# Altium project ZYNQ-HS-DEV.PrjPcb (part 4 of 4)

## Sheet ZHSD-PL-CONNS.SchDoc
size A4; DrawnBy: UGUR KELES; DocumentNumber: 17; SheetNumber: 17; SheetTotal: 17; Size: A4
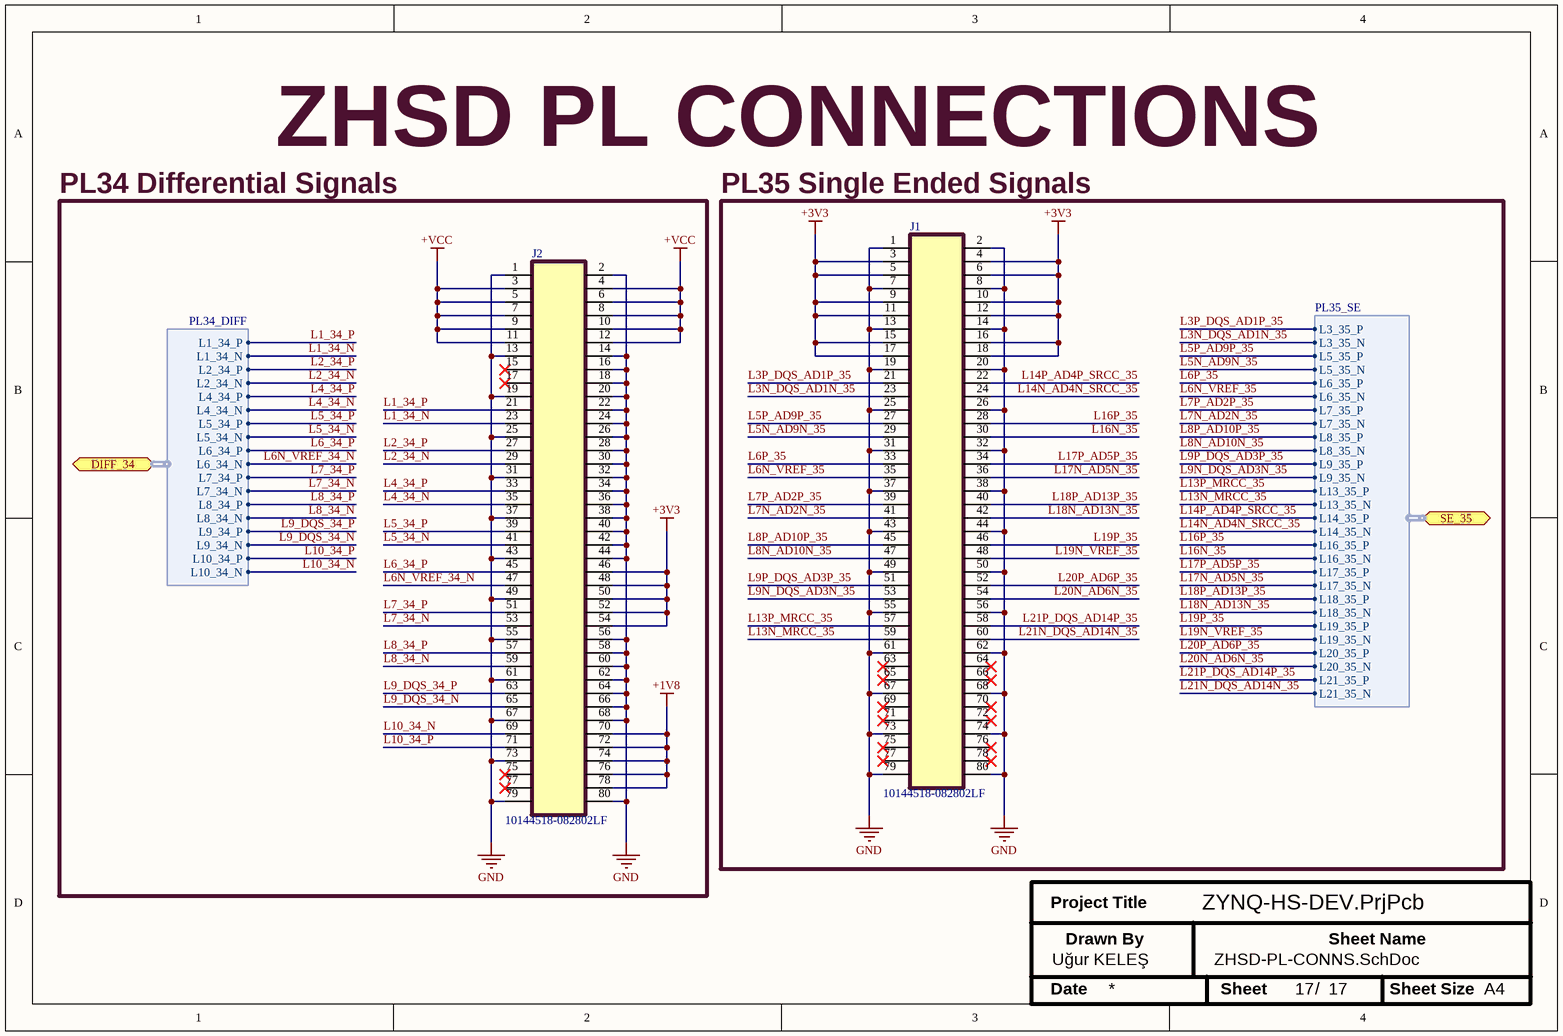
[diagram p16: ZHSD-PL-CONNS.SchDoc]

### Parts
J1  10144518-082802LF  [10144518-082802LF]
J2  10144518-082802LF  [10144518-082802LF]

### Blocks framed on the sheet
PL34 Differential Signals: J2
PL35 Single Ended Signals: J1

### Ports
DIFF_34 (bidir, harness PL34_DIFF, see ZHSD-Block[8400,1700], ZHSD-ZYNQ-PL[8700,7800]), SE_35 (bidir, harness PL35_SE, see ZHSD-Block[8400,1400], ZHSD-ZYNQ-PL[14400,2800])

### Harnesses
PL34_DIFF: L1_34_P, L1_34_N, L2_34_P, L2_34_N, L4_34_P, L4_34_N, L5_34_P, L5_34_N, L6_34_P, L6_34_N, L7_34_P, L7_34_N, L8_34_P, L8_34_N, L9_34_P, L9_34_N, L10_34_P, L10_34_N
PL35_SE: L3_35_P, L3_35_N, L5_35_P, L5_35_N, L6_35_P, L6_35_N, L7_35_P, L7_35_N, L8_35_P, L8_35_N, L9_35_P, L9_35_N, L13_35_P, L13_35_N, L14_35_P, L14_35_N, L16_35_P, L16_35_N, L17_35_P, L17_35_N, L18_35_P, L18_35_N, L19_35_P, L19_35_N, L20_35_P, L20_35_N, L21_35_P, L21_35_N

### Nets
+1V8: J2.70 J2.72 J2.74 J2.76 J2.78
+3V3: J1.3 J1.4 J1.5 J1.6 J1.9 J1.10 J1.11 J1.12 J1.15 J1.16 J1.17 J1.18 J2.46 J2.48 J2.50 J2.52 J2.54
+VCC: J2.3 J2.4 J2.5 J2.6 J2.7 J2.8 J2.9 J2.10 J2.11 J2.12
GND: J1.1 J1.2 J1.7 J1.8 J1.13 J1.14 J1.19 J1.20 J1.25 J1.26 J1.31 J1.32 J1.37 J1.38 J1.43 J1.44 J1.49 J1.50 J1.55 J1.56 J1.61 J1.62 J1.67 J1.68 J1.73 J1.74 J1.79 J1.80 J2.1 J2.2 J2.13 J2.14 J2.16 J2.18 J2.19 J2.20 J2.22 J2.24 J2.25 J2.26 J2.28 J2.30 J2.31 J2.32 J2.34 J2.36 J2.37 J2.38 J2.40 J2.42 J2.43 J2.44 J2.49 J2.55 J2.56 J2.58 J2.60 J2.61 J2.62 J2.64 J2.66 J2.67 J2.68 J2.73 J2.79 J2.80
L1_34_N: J2.23 ; port DIFF_34.L1_34_N  [project net DIFF34.L1_34_N]
L1_34_P: J2.21 ; port DIFF_34.L1_34_P  [project net DIFF34.L1_34_P]
L2_34_N: J2.29 ; port DIFF_34.L2_34_N  [project net DIFF34.L2_34_N]
L2_34_P: J2.27 ; port DIFF_34.L2_34_P  [project net DIFF34.L2_34_P]
L3N_DQS_AD1N_35: J1.23 ; port SE_35.L3_35_N  [project net SE35.L3_35_N]
L3P_DQS_AD1P_35: J1.21 ; port SE_35.L3_35_P  [project net SE35.L3_35_P]
L4_34_N: J2.35 ; port DIFF_34.L4_34_N  [project net DIFF34.L4_34_N]
L4_34_P: J2.33 ; port DIFF_34.L4_34_P  [project net DIFF34.L4_34_P]
L5_34_N: J2.41 ; port DIFF_34.L5_34_N  [project net DIFF34.L5_34_N]
L5_34_P: J2.39 ; port DIFF_34.L5_34_P  [project net DIFF34.L5_34_P]
L5N_AD9N_35: J1.29 ; port SE_35.L5_35_N  [project net SE35.L5_35_N]
L5P_AD9P_35: J1.27 ; port SE_35.L5_35_P  [project net SE35.L5_35_P]
L6_34_P: J2.45 ; port DIFF_34.L6_34_P  [project net DIFF34.L6_34_P]
L6N_VREF_34_N: J2.47 ; port DIFF_34.L6_34_N  [project net DIFF34.L6_34_N]
L6N_VREF_35: J1.35 ; port SE_35.L6_35_N  [project net SE35.L6_35_N]
L6P_35: J1.33 ; port SE_35.L6_35_P  [project net SE35.L6_35_P]
L7_34_N: J2.53 ; port DIFF_34.L7_34_N  [project net DIFF34.L7_34_N]
L7_34_P: J2.51 ; port DIFF_34.L7_34_P  [project net DIFF34.L7_34_P]
L7N_AD2N_35: J1.41 ; port SE_35.L7_35_N  [project net SE35.L7_35_N]
L7P_AD2P_35: J1.39 ; port SE_35.L7_35_P  [project net SE35.L7_35_P]
L8_34_N: J2.59 ; port DIFF_34.L8_34_N  [project net DIFF34.L8_34_N]
L8_34_P: J2.57 ; port DIFF_34.L8_34_P  [project net DIFF34.L8_34_P]
L8N_AD10N_35: J1.47 ; port SE_35.L8_35_N  [project net SE35.L8_35_N]
L8P_AD10P_35: J1.45 ; port SE_35.L8_35_P  [project net SE35.L8_35_P]
L9_DQS_34_N: J2.65 ; port DIFF_34.L9_34_N  [project net DIFF34.L9_34_N]
L9_DQS_34_P: J2.63 ; port DIFF_34.L9_34_P  [project net DIFF34.L9_34_P]
L9N_DQS_AD3N_35: J1.53 ; port SE_35.L9_35_N  [project net SE35.L9_35_N]
L9P_DQS_AD3P_35: J1.51 ; port SE_35.L9_35_P  [project net SE35.L9_35_P]
L10_34_N: J2.69 ; port DIFF_34.L10_34_N  [project net DIFF34.L10_34_N]
L10_34_P: J2.71 ; port DIFF_34.L10_34_P  [project net DIFF34.L10_34_P]
L13N_MRCC_35: J1.59 ; port SE_35.L13_35_N  [project net SE35.L13_35_N]
L13P_MRCC_35: J1.57 ; port SE_35.L13_35_P  [project net SE35.L13_35_P]
L14N_AD4N_SRCC_35: J1.24 ; port SE_35.L14_35_N  [project net SE35.L14_35_N]
L14P_AD4P_SRCC_35: J1.22 ; port SE_35.L14_35_P  [project net SE35.L14_35_P]
L16N_35: J1.30 ; port SE_35.L16_35_N  [project net SE35.L16_35_N]
L16P_35: J1.28 ; port SE_35.L16_35_P  [project net SE35.L16_35_P]
L17N_AD5N_35: J1.36 ; port SE_35.L17_35_N  [project net SE35.L17_35_N]
L17P_AD5P_35: J1.34 ; port SE_35.L17_35_P  [project net SE35.L17_35_P]
L18N_AD13N_35: J1.42 ; port SE_35.L18_35_N  [project net SE35.L18_35_N]
L18P_AD13P_35: J1.40 ; port SE_35.L18_35_P  [project net SE35.L18_35_P]
L19N_VREF_35: J1.48 ; port SE_35.L19_35_N  [project net SE35.L19_35_N]
L19P_35: J1.46 ; port SE_35.L19_35_P  [project net SE35.L19_35_P]
L20N_AD6N_35: J1.54 ; port SE_35.L20_35_N  [project net SE35.L20_35_N]
L20P_AD6P_35: J1.52 ; port SE_35.L20_35_P  [project net SE35.L20_35_P]
L21N_DQS_AD14N_35: J1.60 ; port SE_35.L21_35_N  [project net SE35.L21_35_N]
L21P_DQS_AD14P_35: J1.58 ; port SE_35.L21_35_P  [project net SE35.L21_35_P]

Not connected (* = marked no-connect by the designer): J1 63* 64* 65* 66* 69* 70* 71* 72* 75* 76* 77* 78*; J2 15* 17* 75* 77*

### Notes on the sheet
- ZHSD PL CONNECTIONS
- Project Title
- Uğur KELEŞ
- Drawn By
- Sheet Name
- Date
- Sheet
- /
- Sheet Size
- A4

### Library data of the parts
J1 J2 = 10144518-082802LF: BergStak® Lite 0.80mm, Board-to-Board Connector, 80 Positions, Dual Row, Vertical Header; Manufacturer: Amphenol; MPN: 10144518-082802LF

## Nets that join several sheets
+1V0: ZHSD-ZYNQ-PWR (32 pins), ZHSD-POWER (5 pins)
+1V8: ZHSD-ZYNQ-CONFIG (U300.F11 U300.J9), ZHSD-ZYNQ-PWR (25 pins), ZHSD-ZYNQ-MIO (10 pins), ZHSD-USB-OTG (8 pins), ZHSD-ETHERNET (C1110.2 C1111.2 FB1101.1), ZHSD-USB-UART (Q1200.1 Q1201.1 R1201.1 R1204.1), ZHSD-RS485-CAN (7 pins), ZHSD-HDMI (FB1501.1 FB1502.1 FB1503.1), ZHSD-POWER (5 pins), ZHSD-PL-CONNS (5 pins)
+1V35: ZHSD-ZYNQ-PWR (16 pins), ZHSD-ZYNQ-DDR (R625.2), ZHSD-DDR3L (76 pins), ZHSD-POWER (8 pins)
+3V3: ZHSD-ZYNQ-CONFIG (10 pins), ZHSD-JTAG (C516.2 J501.6), ZHSD-ZYNQ-PWR (44 pins), ZHSD-BOOT-STORAGE (34 pins), ZHSD-ZYNQ-MIO (9 pins), ZHSD-USB-OTG (9 pins), ZHSD-ETHERNET (13 pins), ZHSD-RS485-CAN (6 pins), ZHSD-ZYNQ-PL (7 pins), ZHSD-HDMI (8 pins), ZHSD-MIPI-CSI2 (J1600.15 R1604.2 R1605.2), ZHSD-POWER (9 pins), ZHSD-PL-CONNS (17 pins)
+5V: ZHSD-USB-OTG (C1007.2 U1001.5), ZHSD-RS485-CAN (5 pins), ZHSD-HDMI (C1511.2 J1500.18 R1503.2 R1504.2), ZHSD-POWER (17 pins)
+VCC: ZHSD-POWER (6 pins), ZHSD-PL-CONNS (10 pins)
CHASSIS: ZHSD-JTAG (J500.SH), ZHSD-ZYNQ-PWR (C357.2 R300.1), ZHSD-USB-OTG (J1000.SH), ZHSD-ETHERNET (J1100.SH), ZHSD-USB-UART (J1200.SH), ZHSD-HDMI (J1500.S1 J1500.S2 J1500.S3 J1500.S4)
GND: ZHSD-ZYNQ-CONFIG (10 pins), ZHSD-JTAG (39 pins), ZHSD-ZYNQ-PWR (118 pins), ZHSD-BOOT-STORAGE (31 pins), ZHSD-ZYNQ-MIO (19 pins), ZHSD-USB-OTG (20 pins), ZHSD-ETHERNET (27 pins), ZHSD-USB-UART (12 pins), ZHSD-RS485-CAN (13 pins), ZHSD-ZYNQ-PL (9 pins), ZHSD-HDMI (86 pins), ZHSD-MIPI-CSI2 (J1600.1 J1600.4 J1600.7 J1600.10), ZHSD-ZYNQ-DDR (15 pins), ZHSD-DDR3L (86 pins), ZHSD-POWER (43 pins), ZHSD-PL-CONNS (66 pins)
VTT: ZHSD-ZYNQ-DDR (35 pins), ZHSD-POWER (C212.2 U203.3 U203.5)
VTT_REF: ZHSD-ZYNQ-DDR (C600.2 C601.2 U300.H6 U300.P6), ZHSD-DDR3L (6 pins), ZHSD-POWER (C213.2 U203.6)
3V3_PG: ZHSD-ZYNQ-MIO (C802.2 R801.1 U800.2), ZHSD-POWER (R211.2 U205.8)
CAM_CLK: ZHSD-ZYNQ-PL (U300.U9), ZHSD-MIPI-CSI2 (J1600.12)
CAM_GPIO: ZHSD-ZYNQ-PL (U300.U7), ZHSD-MIPI-CSI2 (J1600.11)
CAM_SCL: ZHSD-ZYNQ-PL (U300.T5), ZHSD-MIPI-CSI2 (J1600.13 R1605.1)
CAM_SDA: ZHSD-ZYNQ-PL (U300.U5), ZHSD-MIPI-CSI2 (J1600.14 R1604.1)
DDR_A0: ZHSD-ZYNQ-DDR (R600.2 U300.N2), ZHSD-DDR3L (U700.N3 U701.N3)
DDR_A1: ZHSD-ZYNQ-DDR (R601.2 U300.K2), ZHSD-DDR3L (U700.P7 U701.P7)
DDR_A2: ZHSD-ZYNQ-DDR (R602.2 U300.M3), ZHSD-DDR3L (U700.P3 U701.P3)
DDR_A3: ZHSD-ZYNQ-DDR (R603.2 U300.K3), ZHSD-DDR3L (U700.N2 U701.N2)
DDR_A4: ZHSD-ZYNQ-DDR (R604.2 U300.M4), ZHSD-DDR3L (U700.P8 U701.P8)
DDR_A5: ZHSD-ZYNQ-DDR (R605.2 U300.L1), ZHSD-DDR3L (U700.P2 U701.P2)
DDR_A6: ZHSD-ZYNQ-DDR (R606.2 U300.L4), ZHSD-DDR3L (U700.R8 U701.R8)
DDR_A7: ZHSD-ZYNQ-DDR (R607.2 U300.K4), ZHSD-DDR3L (U700.R2 U701.R2)
DDR_A8: ZHSD-ZYNQ-DDR (R608.2 U300.K1), ZHSD-DDR3L (U700.T8 U701.T8)
DDR_A9: ZHSD-ZYNQ-DDR (R609.2 U300.J4), ZHSD-DDR3L (U700.R3 U701.R3)
DDR_A10: ZHSD-ZYNQ-DDR (R610.2 U300.F5), ZHSD-DDR3L (U700.L7 U701.L7)
DDR_A11: ZHSD-ZYNQ-DDR (R611.2 U300.G4), ZHSD-DDR3L (U700.R7 U701.R7)
DDR_A12: ZHSD-ZYNQ-DDR (R612.2 U300.E4), ZHSD-DDR3L (U700.N7 U701.N7)
DDR_A13: ZHSD-ZYNQ-DDR (R613.2 U300.D4), ZHSD-DDR3L (U700.T3 U701.T3)
DDR_A14: ZHSD-ZYNQ-DDR (R614.2 U300.F4), ZHSD-DDR3L (U700.T7 U701.T7)
DDR_BA0: ZHSD-ZYNQ-DDR (R615.2 U300.L5), ZHSD-DDR3L (U700.M2 U701.M2)
DDR_BA1: ZHSD-ZYNQ-DDR (R616.2 U300.R4), ZHSD-DDR3L (U700.N8 U701.N8)
DDR_BA2: ZHSD-ZYNQ-DDR (R617.2 U300.J5), ZHSD-DDR3L (U700.M3 U701.M3)
DDR_CAS_B: ZHSD-ZYNQ-DDR (R620.2 U300.P5), ZHSD-DDR3L (U700.K3 U701.K3)
DDR_CK_N: ZHSD-ZYNQ-DDR (R624.1 U300.M2), ZHSD-DDR3L (U700.K7 U701.K7)
DDR_CK_P: ZHSD-ZYNQ-DDR (R624.2 U300.L2), ZHSD-DDR3L (U700.J7 U701.J7)
DDR_CKE: ZHSD-ZYNQ-DDR (R623.2 U300.N3), ZHSD-DDR3L (U700.K9 U701.K9)
DDR_CS_B: ZHSD-ZYNQ-DDR (R618.2 U300.N1), ZHSD-DDR3L (U700.L2 U701.L2)
DDR_DM0: ZHSD-ZYNQ-DDR (U300.A1), ZHSD-DDR3L (U700.E7)
DDR_DM1: ZHSD-ZYNQ-DDR (U300.F1), ZHSD-DDR3L (U700.D3)
DDR_DM2: ZHSD-ZYNQ-DDR (U300.T1), ZHSD-DDR3L (U701.E7)
DDR_DM3: ZHSD-ZYNQ-DDR (U300.Y1), ZHSD-DDR3L (U701.D3)
DDR_DQ0: ZHSD-ZYNQ-DDR (U300.C3), ZHSD-DDR3L (U700.A3)
DDR_DQ1: ZHSD-ZYNQ-DDR (U300.B3), ZHSD-DDR3L (U700.A2)
DDR_DQ2: ZHSD-ZYNQ-DDR (U300.A2), ZHSD-DDR3L (U700.C3)
DDR_DQ3: ZHSD-ZYNQ-DDR (U300.A4), ZHSD-DDR3L (U700.C2)
DDR_DQ4: ZHSD-ZYNQ-DDR (U300.D3), ZHSD-DDR3L (U700.B8)
DDR_DQ5: ZHSD-ZYNQ-DDR (U300.D1), ZHSD-DDR3L (U700.C8)
DDR_DQ6: ZHSD-ZYNQ-DDR (U300.C1), ZHSD-DDR3L (U700.A7)
DDR_DQ7: ZHSD-ZYNQ-DDR (U300.E1), ZHSD-DDR3L (U700.D7)
DDR_DQ8: ZHSD-ZYNQ-DDR (U300.E2), ZHSD-DDR3L (U700.F2)
DDR_DQ9: ZHSD-ZYNQ-DDR (U300.E3), ZHSD-DDR3L (U700.H3)
DDR_DQ10: ZHSD-ZYNQ-DDR (U300.G3), ZHSD-DDR3L (U700.G2)
DDR_DQ11: ZHSD-ZYNQ-DDR (U300.H3), ZHSD-DDR3L (U700.F7)
DDR_DQ12: ZHSD-ZYNQ-DDR (U300.J3), ZHSD-DDR3L (U700.E3)
DDR_DQ13: ZHSD-ZYNQ-DDR (U300.H2), ZHSD-DDR3L (U700.H7)
DDR_DQ14: ZHSD-ZYNQ-DDR (U300.H1), ZHSD-DDR3L (U700.H8)
DDR_DQ15: ZHSD-ZYNQ-DDR (U300.J1), ZHSD-DDR3L (U700.F8)
DDR_DQ16: ZHSD-ZYNQ-DDR (U300.P1), ZHSD-DDR3L (U701.G2)
DDR_DQ17: ZHSD-ZYNQ-DDR (U300.P3), ZHSD-DDR3L (U701.H3)
DDR_DQ18: ZHSD-ZYNQ-DDR (U300.R3), ZHSD-DDR3L (U701.F2)
DDR_DQ19: ZHSD-ZYNQ-DDR (U300.R1), ZHSD-DDR3L (U701.E3)
DDR_DQ20: ZHSD-ZYNQ-DDR (U300.T4), ZHSD-DDR3L (U701.H7)
DDR_DQ21: ZHSD-ZYNQ-DDR (U300.U4), ZHSD-DDR3L (U701.H8)
DDR_DQ22: ZHSD-ZYNQ-DDR (U300.U2), ZHSD-DDR3L (U701.F7)
DDR_DQ23: ZHSD-ZYNQ-DDR (U300.U3), ZHSD-DDR3L (U701.F8)
DDR_DQ24: ZHSD-ZYNQ-DDR (U300.V1), ZHSD-DDR3L (U701.C2)
DDR_DQ25: ZHSD-ZYNQ-DDR (U300.Y3), ZHSD-DDR3L (U701.C8)
DDR_DQ26: ZHSD-ZYNQ-DDR (U300.W1), ZHSD-DDR3L (U701.A3)
DDR_DQ27: ZHSD-ZYNQ-DDR (U300.Y4), ZHSD-DDR3L (U701.B8)
DDR_DQ28: ZHSD-ZYNQ-DDR (U300.Y2), ZHSD-DDR3L (U701.C3)
DDR_DQ29: ZHSD-ZYNQ-DDR (U300.W3), ZHSD-DDR3L (U701.A7)
DDR_DQ30: ZHSD-ZYNQ-DDR (U300.V2), ZHSD-DDR3L (U701.A2)
DDR_DQ31: ZHSD-ZYNQ-DDR (U300.V3), ZHSD-DDR3L (U701.D7)
DDR_DQS0_N: ZHSD-ZYNQ-DDR (U300.B2), ZHSD-DDR3L (U700.B7)
DDR_DQS0_P: ZHSD-ZYNQ-DDR (U300.C2), ZHSD-DDR3L (U700.C7)
DDR_DQS1_N: ZHSD-ZYNQ-DDR (U300.F2), ZHSD-DDR3L (U700.G3)
DDR_DQS1_P: ZHSD-ZYNQ-DDR (U300.G2), ZHSD-DDR3L (U700.F3)
DDR_DQS2_N: ZHSD-ZYNQ-DDR (U300.T2), ZHSD-DDR3L (U701.G3)
DDR_DQS2_P: ZHSD-ZYNQ-DDR (U300.R2), ZHSD-DDR3L (U701.F3)
DDR_DQS3_N: ZHSD-ZYNQ-DDR (U300.W4), ZHSD-DDR3L (U701.B7)
DDR_DQS3_P: ZHSD-ZYNQ-DDR (U300.W5), ZHSD-DDR3L (U701.C7)
DDR_DRST_B: ZHSD-ZYNQ-DDR (R626.2 U300.B4), ZHSD-DDR3L (U700.T2 U701.T2)
DDR_ODT: ZHSD-ZYNQ-DDR (R622.2 U300.N5), ZHSD-DDR3L (U700.K1 U701.K1)
DDR_RAS_B: ZHSD-ZYNQ-DDR (R619.2 U300.P4), ZHSD-DDR3L (U700.J3 U701.J3)
DDR_WE_B: ZHSD-ZYNQ-DDR (R621.2 U300.M5), ZHSD-DDR3L (U700.L3 U701.L3)
DIFF34.L1_34_N: ZHSD-ZYNQ-PL (U300.T10), ZHSD-PL-CONNS (J2.23)
DIFF34.L1_34_P: ZHSD-ZYNQ-PL (U300.T11), ZHSD-PL-CONNS (J2.21)
DIFF34.L2_34_N: ZHSD-ZYNQ-PL (U300.U12), ZHSD-PL-CONNS (J2.29)
DIFF34.L2_34_P: ZHSD-ZYNQ-PL (U300.T12), ZHSD-PL-CONNS (J2.27)
DIFF34.L4_34_N: ZHSD-ZYNQ-PL (U300.W13), ZHSD-PL-CONNS (J2.35)
DIFF34.L4_34_P: ZHSD-ZYNQ-PL (U300.V12), ZHSD-PL-CONNS (J2.33)
DIFF34.L5_34_N: ZHSD-ZYNQ-PL (U300.T15), ZHSD-PL-CONNS (J2.41)
DIFF34.L5_34_P: ZHSD-ZYNQ-PL (U300.T14), ZHSD-PL-CONNS (J2.39)
DIFF34.L6_34_N: ZHSD-ZYNQ-PL (U300.R14), ZHSD-PL-CONNS (J2.47)
DIFF34.L6_34_P: ZHSD-ZYNQ-PL (U300.P14), ZHSD-PL-CONNS (J2.45)
DIFF34.L7_34_N: ZHSD-ZYNQ-PL (U300.Y17), ZHSD-PL-CONNS (J2.53)
DIFF34.L7_34_P: ZHSD-ZYNQ-PL (U300.Y16), ZHSD-PL-CONNS (J2.51)
DIFF34.L8_34_N: ZHSD-ZYNQ-PL (U300.Y14), ZHSD-PL-CONNS (J2.59)
DIFF34.L8_34_P: ZHSD-ZYNQ-PL (U300.W14), ZHSD-PL-CONNS (J2.57)
DIFF34.L9_34_N: ZHSD-ZYNQ-PL (U300.U17), ZHSD-PL-CONNS (J2.65)
DIFF34.L9_34_P: ZHSD-ZYNQ-PL (U300.T16), ZHSD-PL-CONNS (J2.63)
DIFF34.L10_34_N: ZHSD-ZYNQ-PL (U300.W15), ZHSD-PL-CONNS (J2.69)
DIFF34.L10_34_P: ZHSD-ZYNQ-PL (U300.V15), ZHSD-PL-CONNS (J2.71)
ETH_MDC: ZHSD-ZYNQ-MIO (U300.C11), ZHSD-ETHERNET (U1100.13)
ETH_MDIO: ZHSD-ZYNQ-MIO (U300.C10), ZHSD-ETHERNET (R1113.1 U1100.14)
ETH_NINT: ZHSD-ZYNQ-MIO (U300.C17), ZHSD-ETHERNET (R1114.1 U1100.31)
ETH_PHY_NRST: ZHSD-ZYNQ-MIO (R805.1 U802.4), ZHSD-ETHERNET (U1100.12)
ETH_RX_CLK: ZHSD-ZYNQ-MIO (U300.B17), ZHSD-ETHERNET (R1109.2 R1110.2)
ETH_RX_CTL: ZHSD-ZYNQ-MIO (U300.D13), ZHSD-ETHERNET (R1108.2 R1111.2)
ETH_RXD0: ZHSD-ZYNQ-MIO (U300.D11), ZHSD-ETHERNET (R1100.1 R1104.2)
ETH_RXD1: ZHSD-ZYNQ-MIO (U300.A16), ZHSD-ETHERNET (R1101.1 R1105.2)
ETH_RXD2: ZHSD-ZYNQ-MIO (U300.F15), ZHSD-ETHERNET (R1102.1 R1106.2 R1112.2)
ETH_RXD3: ZHSD-ZYNQ-MIO (U300.A15), ZHSD-ETHERNET (R1103.1 R1107.2)
ETH_TX_CLK: ZHSD-ZYNQ-MIO (R811.1), ZHSD-ETHERNET (U1100.20)
ETH_TX_CTL: ZHSD-ZYNQ-MIO (R816.1), ZHSD-ETHERNET (U1100.19)
ETH_TXD0: ZHSD-ZYNQ-MIO (R812.1), ZHSD-ETHERNET (U1100.18)
ETH_TXD1: ZHSD-ZYNQ-MIO (R813.1), ZHSD-ETHERNET (U1100.17)
ETH_TXD2: ZHSD-ZYNQ-MIO (R814.1), ZHSD-ETHERNET (U1100.16)
ETH_TXD3: ZHSD-ZYNQ-MIO (R815.1), ZHSD-ETHERNET (U1100.15)
HDMI_CLK: ZHSD-ZYNQ-PL (U300.N17), ZHSD-HDMI (U1500.79)
HDMI_D0: ZHSD-ZYNQ-PL (U300.V16), ZHSD-HDMI (U1500.88)
HDMI_D1: ZHSD-ZYNQ-PL (U300.V17), ZHSD-HDMI (U1500.87)
HDMI_D2: ZHSD-ZYNQ-PL (U300.W16), ZHSD-HDMI (U1500.86)
HDMI_D3: ZHSD-ZYNQ-PL (U300.V18), ZHSD-HDMI (U1500.85)
HDMI_D4: ZHSD-ZYNQ-PL (U300.U18), ZHSD-HDMI (U1500.84)
HDMI_D5: ZHSD-ZYNQ-PL (U300.R17), ZHSD-HDMI (U1500.83)
HDMI_D6: ZHSD-ZYNQ-PL (U300.Y18), ZHSD-HDMI (U1500.82)
HDMI_D7: ZHSD-ZYNQ-PL (U300.W18), ZHSD-HDMI (U1500.81)
HDMI_D8: ZHSD-ZYNQ-PL (U300.P18), ZHSD-HDMI (U1500.80)
HDMI_D9: ZHSD-ZYNQ-PL (U300.Y19), ZHSD-HDMI (U1500.78)
HDMI_D10: ZHSD-ZYNQ-PL (U300.T20), ZHSD-HDMI (U1500.74)
HDMI_D11: ZHSD-ZYNQ-PL (U300.R18), ZHSD-HDMI (U1500.73)
HDMI_D12: ZHSD-ZYNQ-PL (U300.W20), ZHSD-HDMI (U1500.72)
HDMI_D13: ZHSD-ZYNQ-PL (U300.V20), ZHSD-HDMI (U1500.71)
HDMI_D14: ZHSD-ZYNQ-PL (U300.P19), ZHSD-HDMI (U1500.70)
HDMI_D15: ZHSD-ZYNQ-PL (U300.P20), ZHSD-HDMI (U1500.69)
HDMI_DE: ZHSD-ZYNQ-PL (U300.U15), ZHSD-HDMI (U1500.97)
HDMI_HSYNC: ZHSD-ZYNQ-PL (U300.T17), ZHSD-HDMI (U1500.98)
HDMI_I2C_SCL: ZHSD-ZYNQ-PL (U300.N20), ZHSD-HDMI (R1506.1 U1500.55)
HDMI_I2C_SDA: ZHSD-ZYNQ-PL (U300.N18), ZHSD-HDMI (R1507.1 U1500.56)
HDMI_INT: ZHSD-ZYNQ-PL (U300.U19), ZHSD-HDMI (R1508.1 U1500.45)
HDMI_SPDIF: ZHSD-ZYNQ-PL (U300.W19), ZHSD-HDMI (U1500.10)
HDMI_SPDIF_OUT: ZHSD-ZYNQ-PL (U300.U20), ZHSD-HDMI (U1500.46)
HDMI_VSYNC: ZHSD-ZYNQ-PL (U300.R16), ZHSD-HDMI (U1500.2)
LP_CLK_N: ZHSD-ZYNQ-PL (U300.V8), ZHSD-MIPI-CSI2 (R1608.2)
LP_CLK_P: ZHSD-ZYNQ-PL (U300.U8), ZHSD-MIPI-CSI2 (R1610.2)
LP_LANE0_N: ZHSD-ZYNQ-PL (U300.Y13), ZHSD-MIPI-CSI2 (R1600.2)
LP_LANE0_P: ZHSD-ZYNQ-PL (U300.W10), ZHSD-MIPI-CSI2 (R1602.2)
LP_LANE1_N: ZHSD-ZYNQ-PL (U300.W8), ZHSD-MIPI-CSI2 (R1603.2)
LP_LANE1_P: ZHSD-ZYNQ-PL (U300.W9), ZHSD-MIPI-CSI2 (R1607.2)
MIPI_CLK_N: ZHSD-ZYNQ-PL (U300.Y7), ZHSD-MIPI-CSI2 (J1600.8 R1608.1 R1609.2)
MIPI_CLK_P: ZHSD-ZYNQ-PL (U300.Y6), ZHSD-MIPI-CSI2 (J1600.9 R1609.1 R1610.1)
MIPI_LANE0_N: ZHSD-ZYNQ-PL (U300.W11), ZHSD-MIPI-CSI2 (J1600.2 R1600.1 R1601.2)
MIPI_LANE0_P: ZHSD-ZYNQ-PL (U300.Y11), ZHSD-MIPI-CSI2 (J1600.3 R1601.1 R1602.1)
MIPI_LANE1_N: ZHSD-ZYNQ-PL (U300.Y9), ZHSD-MIPI-CSI2 (J1600.5 R1603.1 R1606.2)
MIPI_LANE1_P: ZHSD-ZYNQ-PL (U300.Y8), ZHSD-MIPI-CSI2 (J1600.6 R1606.1 R1607.1)
OTG_CLK: ZHSD-ZYNQ-MIO (U300.A11), ZHSD-USB-OTG (U1000.1)
OTG_DATA0: ZHSD-ZYNQ-MIO (U300.A14), ZHSD-USB-OTG (U1000.3)
OTG_DATA1: ZHSD-ZYNQ-MIO (U300.D15), ZHSD-USB-OTG (U1000.4)
OTG_DATA2: ZHSD-ZYNQ-MIO (U300.A12), ZHSD-USB-OTG (U1000.5)
OTG_DATA3: ZHSD-ZYNQ-MIO (U300.F12), ZHSD-USB-OTG (U1000.6)
OTG_DATA4: ZHSD-ZYNQ-MIO (U300.C16), ZHSD-USB-OTG (U1000.7)
OTG_DATA5: ZHSD-ZYNQ-MIO (U300.A10), ZHSD-USB-OTG (U1000.9)
OTG_DATA6: ZHSD-ZYNQ-MIO (U300.E13), ZHSD-USB-OTG (U1000.10)
OTG_DATA7: ZHSD-ZYNQ-MIO (U300.C18), ZHSD-USB-OTG (U1000.13)
OTG_DIR: ZHSD-ZYNQ-MIO (U300.C13), ZHSD-USB-OTG (U1000.31)
OTG_NXT: ZHSD-ZYNQ-MIO (U300.E16), ZHSD-USB-OTG (U1000.2)
OTG_RST: ZHSD-ZYNQ-MIO (U300.D14), ZHSD-USB-OTG (R1001.1 U1000.27)
OTG_STP: ZHSD-ZYNQ-MIO (U300.C15), ZHSD-USB-OTG (U1000.29)
PL_CLK_125: ZHSD-ETHERNET (R1121.2), ZHSD-ZYNQ-PL (U300.K17)
PS_QSPI_IO0_M3: ZHSD-BOOT-STORAGE (R912.2 U901.5), ZHSD-ZYNQ-MIO (U300.B8)
PS_QSPI_IO1_M1: ZHSD-BOOT-STORAGE (R914.2 U901.2), ZHSD-ZYNQ-MIO (U300.D6)
PS_QSPI_IO2_M2: ZHSD-BOOT-STORAGE (R915.2 U901.3), ZHSD-ZYNQ-MIO (U300.B7)
PS_QSPI_IO3_M0: ZHSD-BOOT-STORAGE (R911.2 U901.7), ZHSD-ZYNQ-MIO (U300.A6)
PS_QSPI_SCK_M4: ZHSD-BOOT-STORAGE (R913.2 U901.6), ZHSD-ZYNQ-MIO (R806.1)
PS_QSPI_SS: ZHSD-BOOT-STORAGE (R908.1 U901.1), ZHSD-ZYNQ-MIO (U300.A7)
PS_SD_CLK: ZHSD-BOOT-STORAGE (R900.1 U900.M6), ZHSD-ZYNQ-MIO (R809.1)
PS_SD_CMD: ZHSD-BOOT-STORAGE (R901.1 U900.M5), ZHSD-ZYNQ-MIO (U300.C6)
PS_SD_IO0: ZHSD-BOOT-STORAGE (R905.1 U900.A3), ZHSD-ZYNQ-MIO (U300.E9)
PS_SD_IO1: ZHSD-BOOT-STORAGE (R904.1 U900.A4), ZHSD-ZYNQ-MIO (U300.E8)
PS_SD_IO2: ZHSD-BOOT-STORAGE (R903.1 U900.A5), ZHSD-ZYNQ-MIO (U300.C5)
PS_SD_IO3: ZHSD-BOOT-STORAGE (R902.1 U900.B2), ZHSD-ZYNQ-MIO (U300.C8)
RSCAN.CAN_RX: ZHSD-ZYNQ-MIO (U300.B15), ZHSD-RS485-CAN (U1301.B3)
RSCAN.CAN_STB: ZHSD-ZYNQ-MIO (U300.A9), ZHSD-RS485-CAN (U1301.C3)
RSCAN.CAN_TX: ZHSD-ZYNQ-MIO (U300.F13), ZHSD-RS485-CAN (U1301.A3)
RSCAN.RS485_DE: ZHSD-ZYNQ-MIO (U300.B5), ZHSD-RS485-CAN (U1302.2 U1302.3)
RSCAN.RS485_RX: ZHSD-ZYNQ-MIO (U300.D16), ZHSD-RS485-CAN (Q1300.2 R1302.2)
RSCAN.RS485_TX: ZHSD-ZYNQ-MIO (U300.B14), ZHSD-RS485-CAN (Q1301.2 R1306.2)
SD_RST: ZHSD-BOOT-STORAGE (R907.1), ZHSD-ZYNQ-MIO (Q800.3)
SE35.L3_35_N: ZHSD-ZYNQ-PL (U300.D19), ZHSD-PL-CONNS (J1.23)
SE35.L3_35_P: ZHSD-ZYNQ-PL (U300.D18), ZHSD-PL-CONNS (J1.21)
SE35.L5_35_N: ZHSD-ZYNQ-PL (U300.F16), ZHSD-PL-CONNS (J1.29)
SE35.L5_35_P: ZHSD-ZYNQ-PL (U300.E19), ZHSD-PL-CONNS (J1.27)
SE35.L6_35_N: ZHSD-ZYNQ-PL (U300.M19), ZHSD-PL-CONNS (J1.35)
SE35.L6_35_P: ZHSD-ZYNQ-PL (U300.F17), ZHSD-PL-CONNS (J1.33)
SE35.L7_35_N: ZHSD-ZYNQ-PL (U300.M17), ZHSD-PL-CONNS (J1.41)
SE35.L7_35_P: ZHSD-ZYNQ-PL (U300.M20), ZHSD-PL-CONNS (J1.39)
SE35.L8_35_N: ZHSD-ZYNQ-PL (U300.L19), ZHSD-PL-CONNS (J1.47)
SE35.L8_35_P: ZHSD-ZYNQ-PL (U300.M18), ZHSD-PL-CONNS (J1.45)
SE35.L9_35_N: ZHSD-ZYNQ-PL (U300.K19), ZHSD-PL-CONNS (J1.53)
SE35.L9_35_P: ZHSD-ZYNQ-PL (U300.L20), ZHSD-PL-CONNS (J1.51)
SE35.L13_35_N: ZHSD-ZYNQ-PL (U300.J18), ZHSD-PL-CONNS (J1.59)
SE35.L13_35_P: ZHSD-ZYNQ-PL (U300.H17), ZHSD-PL-CONNS (J1.57)
SE35.L14_35_N: ZHSD-ZYNQ-PL (U300.F19), ZHSD-PL-CONNS (J1.24)
SE35.L14_35_P: ZHSD-ZYNQ-PL (U300.H18), ZHSD-PL-CONNS (J1.22)
SE35.L16_35_N: ZHSD-ZYNQ-PL (U300.J20), ZHSD-PL-CONNS (J1.30)
SE35.L16_35_P: ZHSD-ZYNQ-PL (U300.G18), ZHSD-PL-CONNS (J1.28)
SE35.L17_35_N: ZHSD-ZYNQ-PL (U300.G19), ZHSD-PL-CONNS (J1.36)
SE35.L17_35_P: ZHSD-ZYNQ-PL (U300.H20), ZHSD-PL-CONNS (J1.34)
SE35.L18_35_N: ZHSD-ZYNQ-PL (U300.H15), ZHSD-PL-CONNS (J1.42)
SE35.L18_35_P: ZHSD-ZYNQ-PL (U300.G20), ZHSD-PL-CONNS (J1.40)
SE35.L19_35_N: ZHSD-ZYNQ-PL (U300.K14), ZHSD-PL-CONNS (J1.48)
SE35.L19_35_P: ZHSD-ZYNQ-PL (U300.G15), ZHSD-PL-CONNS (J1.46)
SE35.L20_35_N: ZHSD-ZYNQ-PL (U300.N15), ZHSD-PL-CONNS (J1.54)
SE35.L20_35_P: ZHSD-ZYNQ-PL (U300.J14), ZHSD-PL-CONNS (J1.52)
SE35.L21_35_N: ZHSD-ZYNQ-PL (U300.L14), ZHSD-PL-CONNS (J1.60)
SE35.L21_35_P: ZHSD-ZYNQ-PL (U300.N16), ZHSD-PL-CONNS (J1.58)
TCK_0: ZHSD-ZYNQ-CONFIG (R400.1 U300.J6), ZHSD-JTAG (R500.2 R505.1)
TDI_0: ZHSD-ZYNQ-CONFIG (U300.G6), ZHSD-JTAG (R502.2 R507.1)
TDO_0: ZHSD-ZYNQ-CONFIG (U300.F6), ZHSD-JTAG (R501.2 R506.1)
TMS_0: ZHSD-ZYNQ-CONFIG (R401.1 U300.F9), ZHSD-JTAG (R503.2 R509.1)
USB_UART_RX: ZHSD-ZYNQ-MIO (U300.C12), ZHSD-USB-UART (Q1200.2 R1201.2)
USB_UART_TX: ZHSD-ZYNQ-MIO (U300.B12), ZHSD-USB-UART (Q1201.2 R1204.2)